# Altium schematic sheet 13_LED_Array.SchDoc
size A3
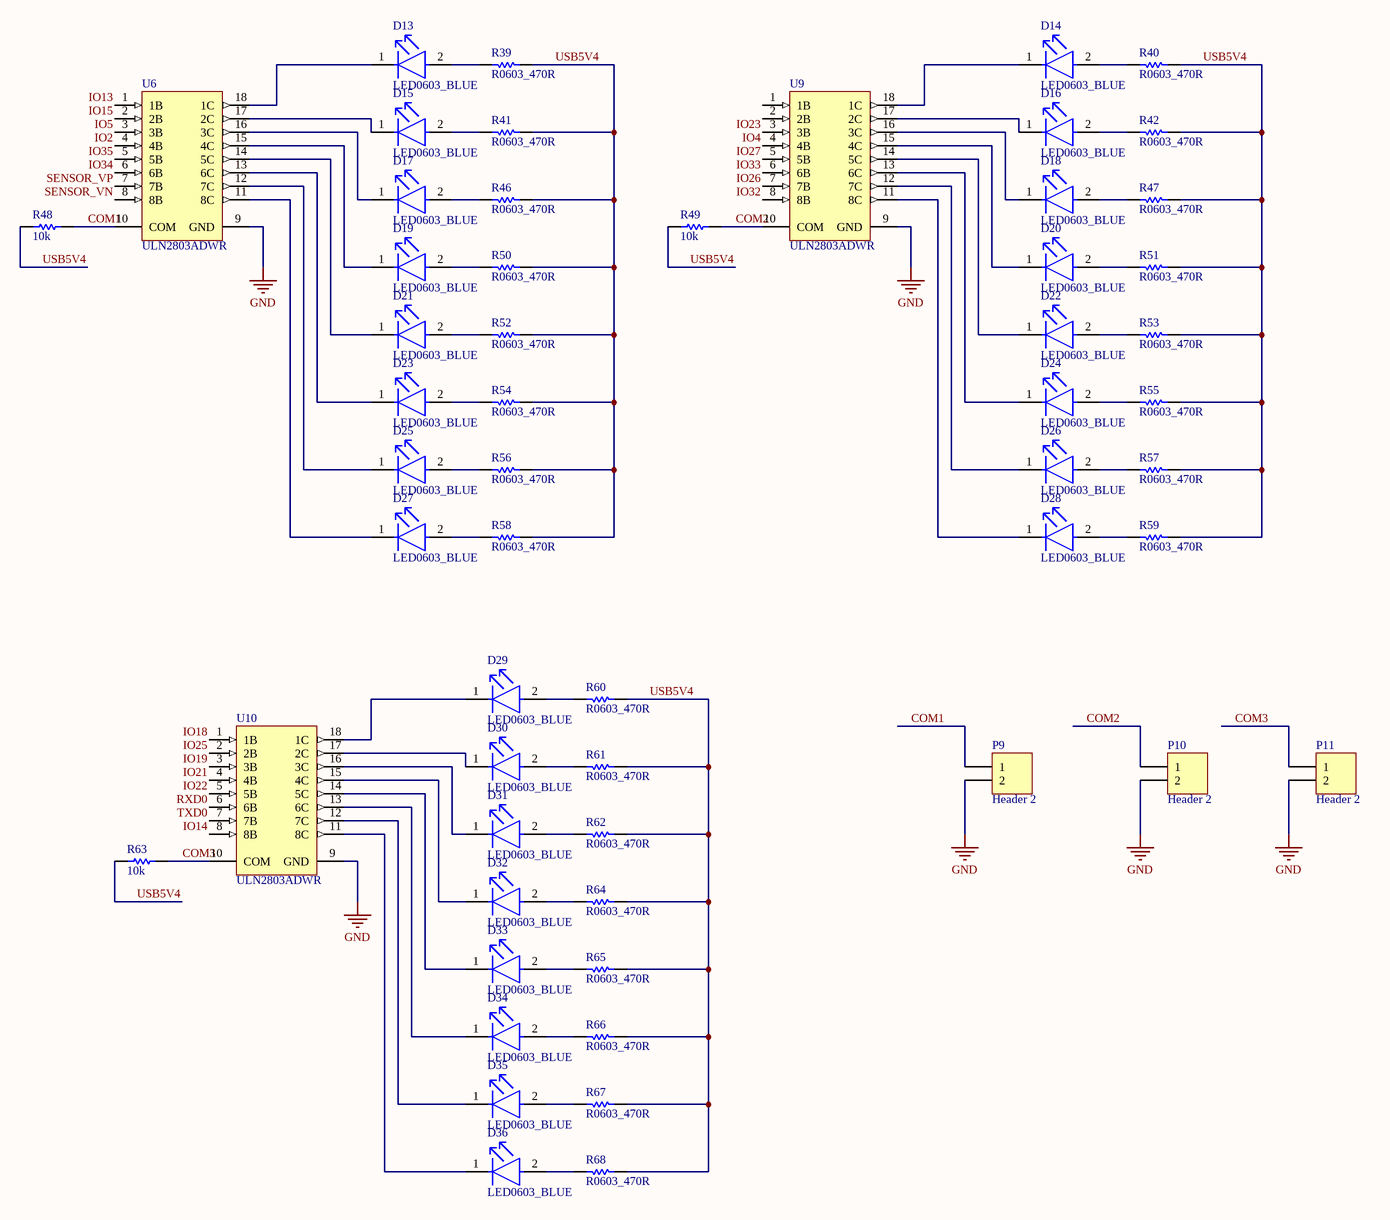
[diagram p0: 13_LED_Array.SchDoc]

## Parts
D13  LED0603_BLUE  [FP-LTST-C191TBKT-MFG]
D14  LED0603_BLUE  [FP-LTST-C191TBKT-MFG]
D15  LED0603_BLUE  [FP-LTST-C191TBKT-MFG]
D16  LED0603_BLUE  [FP-LTST-C191TBKT-MFG]
D17  LED0603_BLUE  [FP-LTST-C191TBKT-MFG]
D18  LED0603_BLUE  [FP-LTST-C191TBKT-MFG]
D19  LED0603_BLUE  [FP-LTST-C191TBKT-MFG]
D20  LED0603_BLUE  [FP-LTST-C191TBKT-MFG]
D21  LED0603_BLUE  [FP-LTST-C191TBKT-MFG]
D22  LED0603_BLUE  [FP-LTST-C191TBKT-MFG]
D23  LED0603_BLUE  [FP-LTST-C191TBKT-MFG]
D24  LED0603_BLUE  [FP-LTST-C191TBKT-MFG]
D25  LED0603_BLUE  [FP-LTST-C191TBKT-MFG]
D26  LED0603_BLUE  [FP-LTST-C191TBKT-MFG]
D27  LED0603_BLUE  [FP-LTST-C191TBKT-MFG]
D28  LED0603_BLUE  [FP-LTST-C191TBKT-MFG]
D29  LED0603_BLUE  [FP-LTST-C191TBKT-MFG]
D30  LED0603_BLUE  [FP-LTST-C191TBKT-MFG]
D31  LED0603_BLUE  [FP-LTST-C191TBKT-MFG]
D32  LED0603_BLUE  [FP-LTST-C191TBKT-MFG]
D33  LED0603_BLUE  [FP-LTST-C191TBKT-MFG]
D34  LED0603_BLUE  [FP-LTST-C191TBKT-MFG]
D35  LED0603_BLUE  [FP-LTST-C191TBKT-MFG]
D36  LED0603_BLUE  [FP-LTST-C191TBKT-MFG]
P9  Header 2  [HDR1X2]
P10  Header 2  [HDR1X2]
P11  Header 2  [HDR1X2]
R39  R0603_470R  [RESC1608X55X30NL15T15]
R40  R0603_470R  [RESC1608X55X30NL15T15]
R41  R0603_470R  [RESC1608X55X30NL15T15]
R42  R0603_470R  [RESC1608X55X30NL15T15]
R46  R0603_470R  [RESC1608X55X30NL15T15]
R47  R0603_470R  [RESC1608X55X30NL15T15]
R48  value 10k  [RESC1609X55X30LL15T15]  (hidden comment: R0603_10K)
R49  value 10k  [RESC1609X55X30LL15T15]  (hidden comment: R0603_10K)
R50  R0603_470R  [RESC1608X55X30NL15T15]
R51  R0603_470R  [RESC1608X55X30NL15T15]
R52  R0603_470R  [RESC1608X55X30NL15T15]
R53  R0603_470R  [RESC1608X55X30NL15T15]
R54  R0603_470R  [RESC1608X55X30NL15T15]
R55  R0603_470R  [RESC1608X55X30NL15T15]
R56  R0603_470R  [RESC1608X55X30NL15T15]
R57  R0603_470R  [RESC1608X55X30NL15T15]
R58  R0603_470R  [RESC1608X55X30NL15T15]
R59  R0603_470R  [RESC1608X55X30NL15T15]
R60  R0603_470R  [RESC1608X55X30NL15T15]
R61  R0603_470R  [RESC1608X55X30NL15T15]
R62  R0603_470R  [RESC1608X55X30NL15T15]
R63  value 10k  [RESC1609X55X30LL15T15]  (hidden comment: R0603_10K)
R64  R0603_470R  [RESC1608X55X30NL15T15]
R65  R0603_470R  [RESC1608X55X30NL15T15]
R66  R0603_470R  [RESC1608X55X30NL15T15]
R67  R0603_470R  [RESC1608X55X30NL15T15]
R68  R0603_470R  [RESC1608X55X30NL15T15]
U6  ULN2803ADWR  [DW0018A_L]
U9  ULN2803ADWR  [DW0018A_L]
U10  ULN2803ADWR  [DW0018A_L]

## Nets
GND: P9.2 P10.2 P11.2 U6.9(GND) U9.9(GND) U10.9(GND)
COM1: P9.1 R48.2 U6.10(COM)
COM2: P10.1 R49.2 U9.10(COM)
COM3: P11.1 R63.2 U10.10(COM)
IO2: U6.4(4B)
IO4: U9.4(4B)
IO5: U6.3(3B)
IO13: U6.1(1B)
IO14: U10.8(8B)
IO15: U6.2(2B)
IO18: U10.1(1B)
IO19: U10.3(3B)
IO21: U10.4(4B)
IO22: U10.5(5B)
IO23: U9.3(3B)
IO25: U10.2(2B)
IO26: U9.7(7B)
IO27: U9.5(5B)
IO32: U9.8(8B)
IO33: U9.6(6B)
IO34: U6.6(6B)
IO35: U6.5(5B)
RXD0: U10.6(6B)
SENSOR_VN: U6.8(8B)
SENSOR_VP: U6.7(7B)
TXD0: U10.7(7B)
USB5V4: R39.1 R40.1 R41.1 R42.1 R46.1 R47.1 R48.1 R49.1 R50.1 R51.1 R52.1 R53.1 R54.1 R55.1 R56.1 R57.1 R58.1 R59.1 R60.1 R61.1 R62.1 R63.1 R64.1 R65.1 R66.1 R67.1 R68.1
NetD13_1: D13.1(C) U6.18(1C)
NetD13_2: D13.2(A) R39.2
NetD14_1: D14.1(C) U9.18(1C)
NetD14_2: D14.2(A) R40.2
NetD15_1: D15.1(C) U6.17(2C)
NetD15_2: D15.2(A) R41.2
NetD16_1: D16.1(C) U9.17(2C)
NetD16_2: D16.2(A) R42.2
NetD17_1: D17.1(C) U6.16(3C)
NetD17_2: D17.2(A) R46.2
NetD18_1: D18.1(C) U9.16(3C)
NetD18_2: D18.2(A) R47.2
NetD19_1: D19.1(C) U6.15(4C)
NetD19_2: D19.2(A) R50.2
NetD20_1: D20.1(C) U9.15(4C)
NetD20_2: D20.2(A) R51.2
NetD21_1: D21.1(C) U6.14(5C)
NetD21_2: D21.2(A) R52.2
NetD22_1: D22.1(C) U9.14(5C)
NetD22_2: D22.2(A) R53.2
NetD23_1: D23.1(C) U6.13(6C)
NetD23_2: D23.2(A) R54.2
NetD24_1: D24.1(C) U9.13(6C)
NetD24_2: D24.2(A) R55.2
NetD25_1: D25.1(C) U6.12(7C)
NetD25_2: D25.2(A) R56.2
NetD26_1: D26.1(C) U9.12(7C)
NetD26_2: D26.2(A) R57.2
NetD27_1: D27.1(C) U6.11(8C)
NetD27_2: D27.2(A) R58.2
NetD28_1: D28.1(C) U9.11(8C)
NetD28_2: D28.2(A) R59.2
NetD29_1: D29.1(C) U10.18(1C)
NetD29_2: D29.2(A) R60.2
NetD30_1: D30.1(C) U10.17(2C)
NetD30_2: D30.2(A) R61.2
NetD31_1: D31.1(C) U10.16(3C)
NetD31_2: D31.2(A) R62.2
NetD32_1: D32.1(C) U10.15(4C)
NetD32_2: D32.2(A) R64.2
NetD33_1: D33.1(C) U10.14(5C)
NetD33_2: D33.2(A) R65.2
NetD34_1: D34.1(C) U10.13(6C)
NetD34_2: D34.2(A) R66.2
NetD35_1: D35.1(C) U10.12(7C)
NetD35_2: D35.2(A) R67.2
NetD36_1: D36.1(C) U10.11(8C)
NetD36_2: D36.2(A) R68.2

Not connected (* = marked no-connect by the designer): U9 1(1B) 2(2B)

## Notes on the sheet
- Title
- Size:
- Date:
- A3
- Number:
- Time:
- Revision:
- Sheet
- of
- File:

## Library data of the parts
D13-D36 = CMP-22017-000008-1: LED BLUE CLEAR CHIP SMD; Lens Color: Colorless; Dominant Wavelength: 475nm; Forward Current: 20mA; Wavelength: 468nm; Viewing Angle: 130°; Power Dissipation: 76mW; Luminous Intensity: 180mcd; Reverse Voltage: 5V; Number of Elements: 1; Lens Style: Diffused; Forward Voltage: 3.8V; Max Power Dissipation: 75mW; Case Code (Metric): 1608; Packaging: Tape and Reel; Case/Package: 0603; Depth: 1.6mm; Mount: Surface Mount; Lead Free: Lead Free; Min Operating Temperature: -20°C; Lens Transparency: Clear; Illumination Color: Blue; Height: 0.55mm; Test Current: 20mA; Case Code (Imperial): 0603; Max Operating Temperature: 80°C; Number of Pins: 2; Length: 0.8mm; Radiation Hardening: No; Package Quantity: 1; Number of LEDs: 1; Width: 0.8mm; Color: Blue
P9-P11 = Header 2: Header, 2-Pin; LatestRevisionDate: 17-Jul-2002; LatestRevisionNote: Re-released for DXP Platform.; Publisher: Altium Limited
R39-R42 R46 R47 R50-R62 R64-R68 = CMP-2000-00795-1: Part Number: ERJ-3GEYJ471V; Manufacturer: Panasonic; Value: 470
R48 R49 R63 = CMP-2000-07452-1: Chip Resistor, 10 KOhm, +/- 1%, 0.1 W, -55 to 155 degC, 0603 (1608 Metric), RoHS, Tape and Reel; Manufacturer: Panasonic; Voltage Rating: 75V; Case\/Package: 0603; Power Rating: 100mW; Resistance: 10KOhm; Temperature Coefficient: 100ppm\/degreesC; Number of Pins: 2; Package Reference: 603; Depth: 0.8mm; Mount: SurfaceMount; Package Description: 2-Pin Surface Mount Device, Body 1.6 x 0.85 mm; Datasheet Version: 02/2017; Length: 1.6mm; Lead Free: LeadFree; Height: 0.45mm; Number of Terminations: 2; Max Power Dissipation: 100mW; Min Operating Temperature: -55degC; Datasheet URL: https://industrial.panasonic.com/cdbs/www-data/pdf/RDA0000/AOA0000C304.pdf; Termination: SMD/SMT; Case Code (Metric): 1608; Case Code (Imperial): 0603; Tolerance: 1%; Max Operating Temperature: 155degC; RoHSCompliant: true; Voltage Rating (DC): 75V; Radiation Hardening: No; Packaging: TapeandReel; Composition: ThickFilm; Mounting Technology: SurfaceMount; Manufacturer URL: http://www.panasonic.com/; Width: 0.031inch; REACH SVHC: NoSVHC; Contact Plating: Tin; Military Standard: Not; Package Quantity: 1
U6 U9 U10 = CMP-2000-07354-1: Darlington Transistor Array, -40 to 85 degC, 18-Pin SOIC (DW), Green (RoHS & no Sb/Br), Tape and Reel; Manufacturer: Texas Instruments; Package Version: 4040000-3/G, 01/2011; Other Names: 296-15777-6; Voltage - Supply: 5V; IR Max: 50uA; Number of Drivers/Receivers: 8/0; VF: 1.7V; Dynamic Catalog: DarlingtonArrays; Package Description: 18-Pin Plastic Small Outline, Body 11.55 x 7.5 mm, Pitch 1.27 mm; Mounting Technology: SurfaceMount; Packaging: Digi-Reel®; Protocol: -; Family: Interface-Drivers,Receivers,Transceivers; Package Reference: DW18; Mounting Type: SurfaceMount; Type: DarlingtonArray; Category: IntegratedCircuits(ICs); Series: -; PartNumber: ULN2803A; Manufacturer URL: http://www.ti.com/; Package / Case: 18-SOIC(0.295",7.50mmWidth); Standard Package: 1; Datasheet Version: Rev. G, 01/2015; Supplier Device Package: 18-SOIC; Package URL: http://www.ti.com/lit/ml/mpds172a/mpds172a.pdf; Datasheet URL: http://www.ti.com/lit/ds/symlink/uln2803a.pdf